# Altium project Battman.PrjPcb (part 1 of 3)
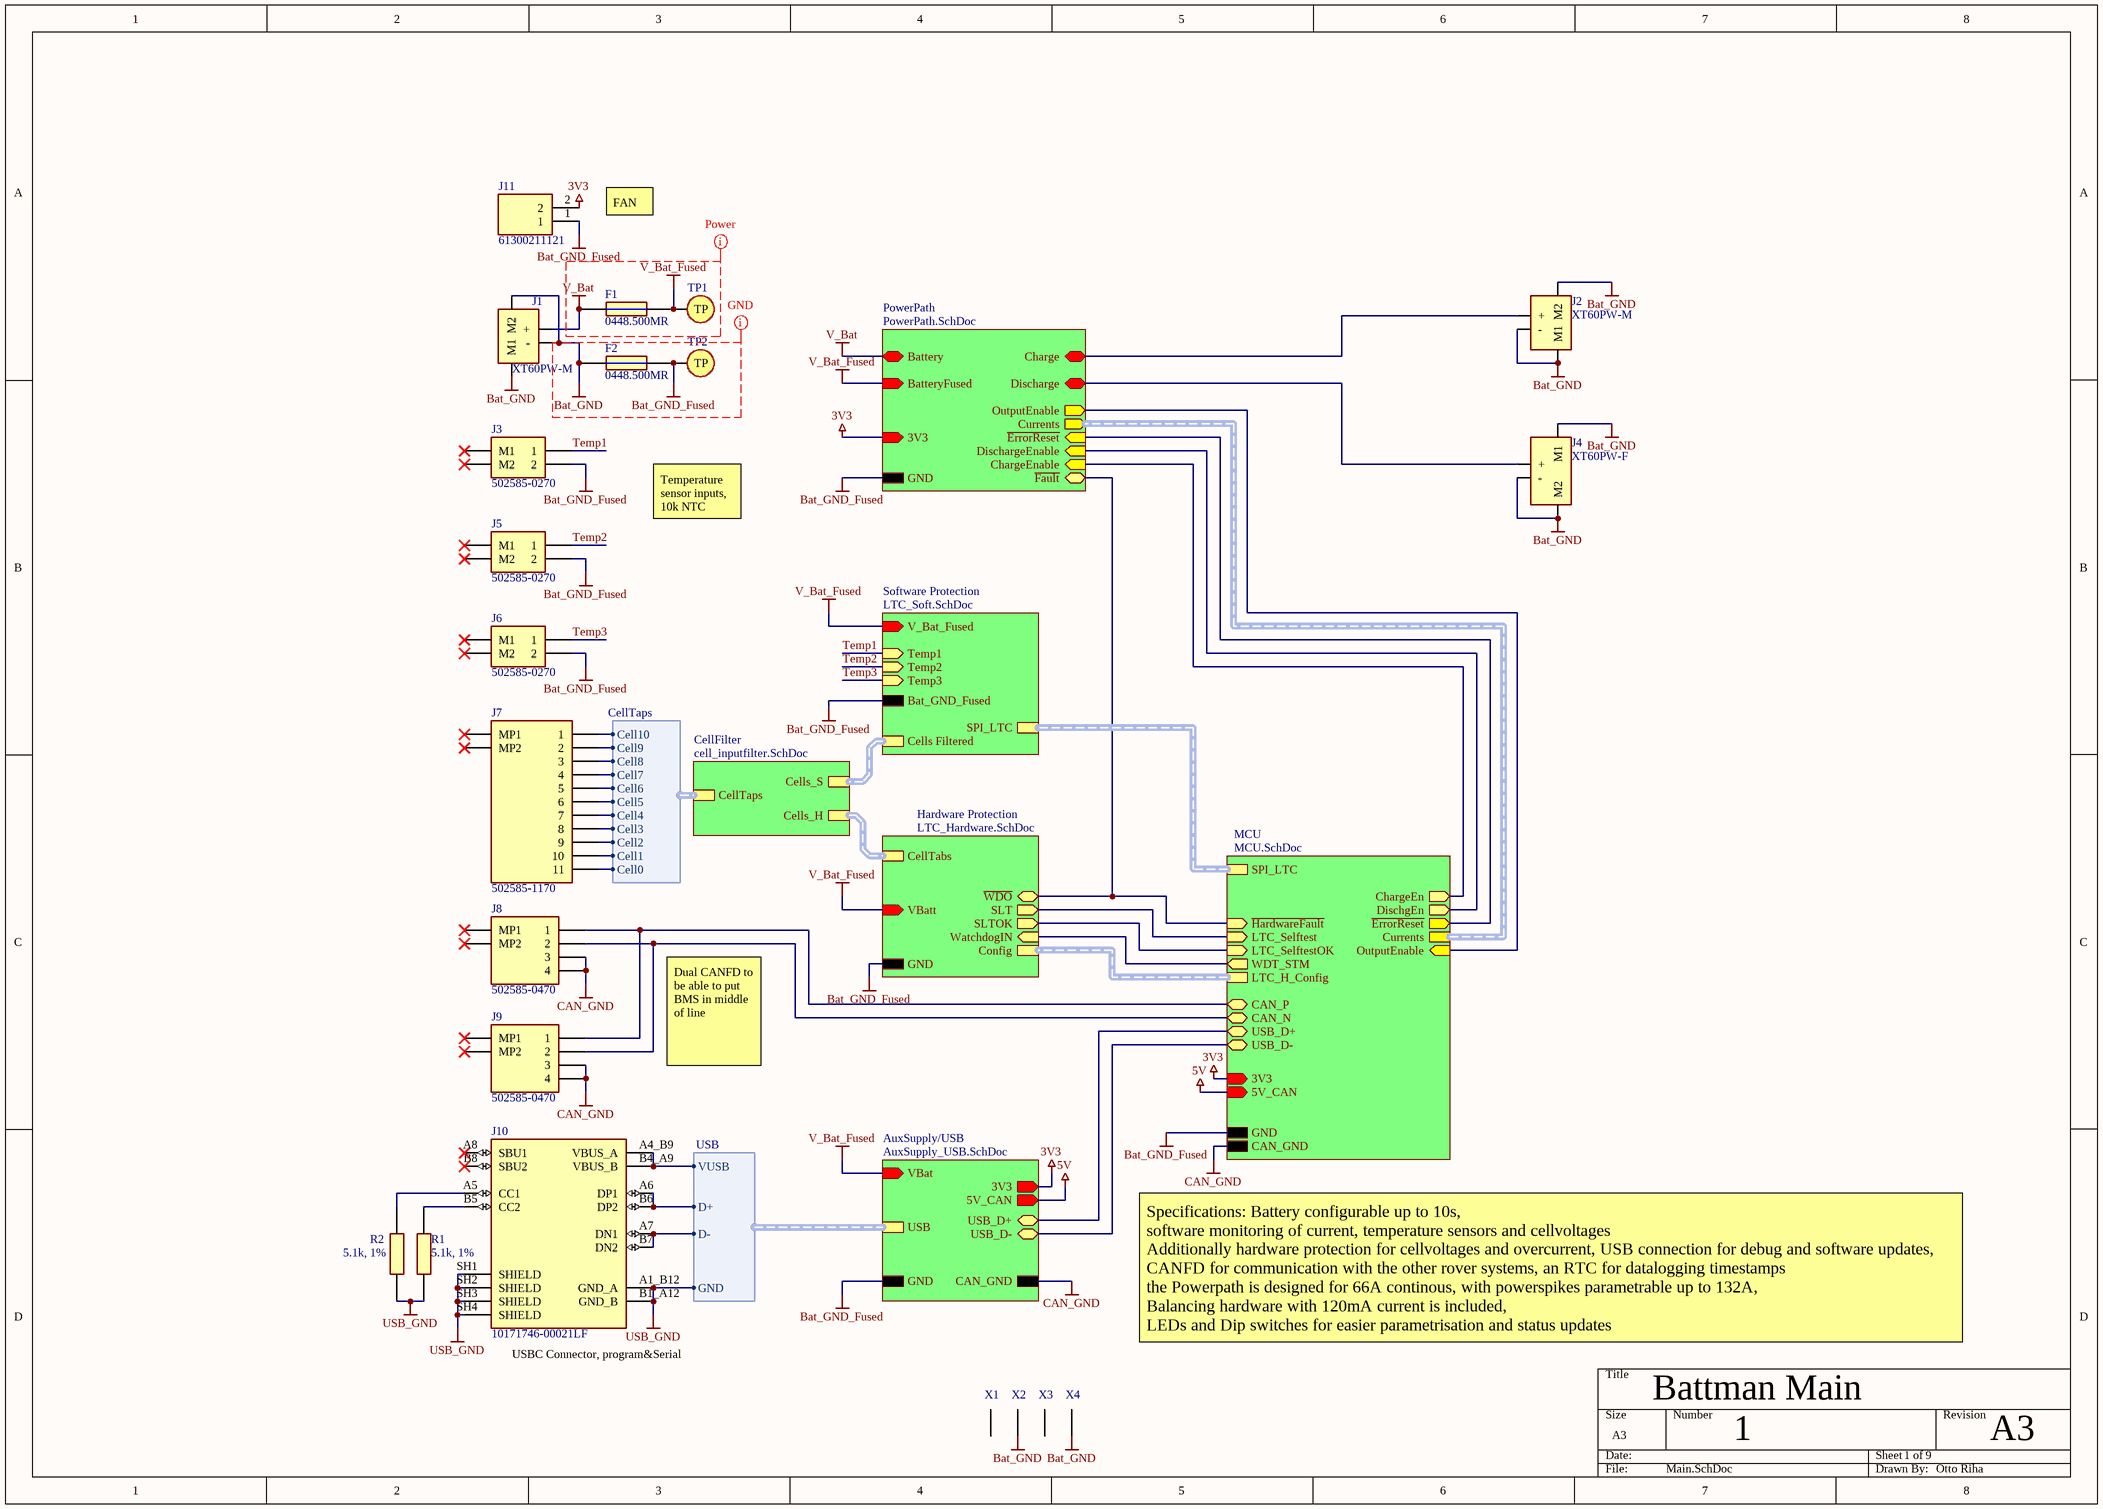
[diagram p0: Main.SchDoc]
10 sheets, 359 parts. Net scope: hierarchical (ports join the sheet entries above them; power ports are global).
Board file: Battman.PcbDoc
Sheets:
  Main.SchDoc
    CellFilter = cell_inputfilter.SchDoc
      CellFilter1 = singlefilter.SchDoc
      CellFilter2 = singlefilter.SchDoc
      CellFilter3 = singlefilter.SchDoc
      CellFilter4 = singlefilter.SchDoc
      CellFilter5 = singlefilter.SchDoc
      CellFilter6 = singlefilter.SchDoc
      CellFilter7 = singlefilter.SchDoc
      CellFilter8 = singlefilter.SchDoc
      CellFilter9 = singlefilter.SchDoc
      CellFilter10 = singlefilter.SchDoc
    Hardware Protection = LTC_Hardware.SchDoc
      Multiplexer1 = ConfigMultiplexer.SchDoc
      Multiplexer2 = ConfigMultiplexer.SchDoc
      Multiplexer3 = ConfigMultiplexer.SchDoc
      Multiplexer4 = ConfigMultiplexer.SchDoc
      Multiplexer5 = ConfigMultiplexer.SchDoc
      Multiplexer6 = ConfigMultiplexer.SchDoc
      Multiplexer7 = ConfigMultiplexer.SchDoc
      Multiplexer8 = ConfigMultiplexer.SchDoc
    AuxSupply/USB = AuxSupply_USB.SchDoc
    Software Protection = LTC_Soft.SchDoc
    MCU = MCU.SchDoc
    PowerPath = PowerPath.SchDoc
      SinglePath1 = Singlepath.SchDoc
      SinglePath2 = Singlepath.SchDoc

## Sheet Main.SchDoc
size A3; SheetNumber: 1; SheetTotal: 10

### Parts
F1  0448.500MR  [FUSC6127X294N]
F2  0448.500MR  [FUSC6127X294N]
J1  XT60PW-M  [XT60PWM]
J2  XT60PW-M  [XT60PWM]
J3  502585-0270  [5025850270]
J4  XT60PW-F  [XT60PWF]
J5  502585-0270  [5025850270]
J6  502585-0270  [5025850270]
J7  502585-1170  [5025851170]
J8  502585-0470  [5025850470]
J9  502585-0470  [5025850470]
J10  10171746-00021LF  [AMPHENOL_10171746-00021LF]
J11  61300211121  [HDRV2W110P0X254_1X2_508X254X854P]
R1  5.1k, 1%  [RESC1608X55N]
R2  5.1k, 1%  [RESC1608X55N]
TP1  Testpoint  [Testpoint]  (value not drawn)
TP2  Testpoint  [Testpoint]  (value not drawn)
X1  Trou pour Vis M3 celon DIN912  [VisM3]  (value not drawn)
X2  Trou pour Vis M3 celon DIN912  [VisM3]  (value not drawn)
X3  Trou pour Vis M3 celon DIN912  [VisM3]  (value not drawn)
X4  Trou pour Vis M3 celon DIN912  [VisM3]  (value not drawn)

### Sub-sheets
AuxSupply/USB = AuxSupply_USB.SchDoc: VBat (in), GND, 5V_CAN (out), 3V3 (out), USB (harness USB), USB_D+ (bidir), USB_D- (bidir), CAN_GND
CellFilter = cell_inputfilter.SchDoc: CellTaps (harness CellTaps), Cells_H (harness Hardware Protection Taps), Cells_S (harness Software Protection Taps)
Hardware Protection = LTC_Hardware.SchDoc: CellTabs (harness Hardware Protection Taps), SLT (out), SLTOK (out), Config (harness LTC_H_Config), WatchdogIN (in), ~{WDO} (bidir), GND, VBatt (in)
MCU = MCU.SchDoc: SPI_LTC (harness SPI_LTC), CAN_P (bidir), CAN_N (bidir), USB_D+ (bidir), USB_D- (bidir), 3V3 (in), 5V_CAN (in), GND, LTC_H_Config (harness LTC_H_Config), ChargeEn (out), DischgEn (out), WDT_STM (out), ~{HardwareFault} (in), LTC_Selftest (in), LTC_SelftestOK (in), ~{ErrorReset} (out), OutputEnable (in), Currents (harness Currents), CAN_GND
PowerPath = PowerPath.SchDoc: Battery (bidir), BatteryFused (in), 3V3 (in), GND, Currents (out), Charge (bidir), ~{Fault} (bidir), Discharge (bidir), ChargeEnable (in), DischargeEnable (in), OutputEnable (out), ~{ErrorReset} (in)
Software Protection = LTC_Soft.SchDoc: Cells Filtered (harness Software Protection Taps), V_Bat_Fused (in), Bat_GND_Fused, Temp1 (in), Temp2 (in), Temp3 (in), SPI_LTC (harness SPI)

### Harnesses
CellTaps: Cell0, Cell1, Cell2, Cell3, Cell4, Cell5, Cell6, Cell7, Cell8, Cell9, Cell10
USB: VUSB, D+, D-, GND

### Nets
3V3: J11.2 ; sheet AuxSupply/USB/3V3, sheet MCU/3V3, sheet PowerPath/3V3  [project net 3.3V]
5V: sheet AuxSupply/USB/5V_CAN, sheet MCU/5V_CAN
5V_USB: J10.A4_B9(VBUS_A) J10.B4_A9(VBUS_B) ; sheet AuxSupply/USB/USB.VUSB
Bat_GND: F2.1 J1.1(-) J1.M1 J1.M2 J2.1(-) J2.M1 J2.M2 J4.2(-) J4.3(M1) J4.4(M2) X2.1(M1) X4.1(M1)
Bat_GND_Fused: F2.2 J3.2 J5.2 J6.2 J11.1 TP2.1(TP) ; sheet Hardware Protection/GND, sheet AuxSupply/USB/GND, sheet Software Protection/Bat_GND_Fused, sheet MCU/GND, sheet PowerPath/GND
CAN_GND: J8.3 J8.4 J9.3 J9.4 ; sheet AuxSupply/USB/CAN_GND, sheet MCU/CAN_GND
USB_GND: J10.A1_B12(GND_A) J10.B1_A12(GND_B) J10.SH1(SHIELD) J10.SH2(SHIELD) J10.SH3(SHIELD) J10.SH4(SHIELD) R1.1 R2.1 ; sheet AuxSupply/USB/USB.GND
V_Bat: F1.1 J1.2(+) ; sheet PowerPath/Battery
V_Bat_Fused: F1.2 TP1.1(TP) ; sheet Hardware Protection/VBatt, sheet AuxSupply/USB/VBat, sheet Software Protection/V_Bat_Fused, sheet PowerPath/BatteryFused
CAN_N: J8.2 J9.2 ; sheet MCU/CAN_N
CAN_P: J8.1 J9.1 ; sheet MCU/CAN_P
Cell1: J7.10 ; sheet CellFilter/CellTaps.Cell1
Cell2: J7.9 ; sheet CellFilter/CellTaps.Cell2
Cell3: J7.8 ; sheet CellFilter/CellTaps.Cell3
Cell4: J7.7 ; sheet CellFilter/CellTaps.Cell4
Cell5: J7.6 ; sheet CellFilter/CellTaps.Cell5
Cell6: J7.5 ; sheet CellFilter/CellTaps.Cell6
Cell7: J7.4 ; sheet CellFilter/CellTaps.Cell7
Cell8: J7.3 ; sheet CellFilter/CellTaps.Cell8
Cell9: J7.2 ; sheet CellFilter/CellTaps.Cell9
Cell10: J7.1 ; sheet CellFilter/CellTaps.Cell10
Enable1: sheet MCU/ChargeEn, sheet PowerPath/ChargeEnable
Enable2: sheet MCU/DischgEn, sheet PowerPath/DischargeEnable
~{Fault}: sheet Hardware Protection/~{WDO}, sheet MCU/~{HardwareFault}, sheet PowerPath/~{Fault}
Out1: J2.2(+) ; sheet PowerPath/Charge
Out2: J4.1(+) ; sheet PowerPath/Discharge
OutputEnable: sheet MCU/OutputEnable, sheet PowerPath/OutputEnable
Temp1: J3.1 ; sheet Software Protection/Temp1
Temp2: J5.1 ; sheet Software Protection/Temp2
Temp3: J6.1 ; sheet Software Protection/Temp3
USB_D_N: J10.A7(DN1) J10.B7(DN2) ; sheet AuxSupply/USB/USB.D-
USB_D_P: J10.A6(DP1) J10.B6(DP2) ; sheet AuxSupply/USB/USB.D+
USB_ISO_N: sheet AuxSupply/USB/USB_D-, sheet MCU/USB_D-
USB_ISO_P: sheet AuxSupply/USB/USB_D+, sheet MCU/USB_D+
NetF100_1: J7.11 ; sheet CellFilter/CellTaps.Cell0
NetIC300_20: sheet Hardware Protection/WatchdogIN, sheet MCU/WDT_STM
NetIC300_28: sheet Hardware Protection/SLTOK, sheet MCU/LTC_SelftestOK
NetIC300_29: sheet Hardware Protection/SLT, sheet MCU/LTC_Selftest
NetIC700#2_27: sheet MCU/~{ErrorReset}, sheet PowerPath/~{ErrorReset}
NetJ10_A5: J10.A5(CC1) R2.2
NetJ10_B5: J10.B5(CC2) R1.2

Not connected (* = marked no-connect by the designer): J3 M1* M2*; J5 M1* M2*; J6 M1* M2*; J7 MP1* MP2*; J8 MP1* MP2*; J9 MP1* MP2*; J10 A8(SBU1)* B8(SBU2)*; X1 1(M1); X3 1(M1)

### Buses and harness runs
harness sheet CellFilter/Cells_H = sheet Hardware Protection/CellTabs
harness sheet CellFilter/Cells_S = sheet Software Protection/Cells Filtered
harness sheet Hardware Protection/Config = sheet MCU/LTC_H_Config
harness sheet MCU/Currents = sheet PowerPath/Currents
harness sheet MCU/SPI_LTC = sheet Software Protection/SPI_LTC

### Layout directives
net class GND: Bat_GND, Bat_GND_Fused
net class Batt+: V_Bat, V_Bat_Fused

### Notes on the sheet
- FAN
- Temperature sensor inputs, 10k NTC
- Dual CANFD to be able to put BMS in middle of line
- (near J10) USBC Connector, program&Serial
- Specifications: Battery configurable up to 10s,
  software monitoring of current, temperature sensors and cellvoltages
  Additionally hardware protection for cellvoltages and overcurrent, USB connection for debug and software updates, CANFD for communication with the other rover systems, an RTC for datalogging timestamps
  the Powerpath is designed for 66A continous, with powerspikes parametrable up to 132A,
  Balancing hardware with 120mA current is included,
  LEDs and Dip switches for easier parametrisation and status updates
- Battman Main
- 1
- 9
- A3
- Otto Riha
- System:
- Car Number:
- Author:
- 127
- Date:
- Sheet
- of
- Version :

### Library data of the parts
F1 F2 = 0448.500MR: Fuse; Manufacturer_Name: LITTELFUSE; Datasheet Link: https://www.mouser.in/datasheet/2/240/Littelfuse_Fuse_448_Datasheet_pdf-970935.pdf; Height: 2.94mm; Manufacturer_Part_Number: 0448.500MR; Mouser Part Number: 576-0448.500MR; Mouser Price/Stock: https://www.mouser.co.uk/ProductDetail/Littelfuse/0448.500MR?qs=sba%2FvSn%252BnuOI9c6%252BQVFrGA%3D%3D; Arrow Part Number: 0448.500MR; Arrow Price/Stock: https://www.arrow.com/en/products/0448.500mr/littelfuse
J1 J2 = XT60PW-M: Connector; Manufacturer_Name: Changzou Amass Elec; Datasheet Link: https://www.tme.eu/Document/9b8d0c5eb7094295f3d3112c214d3ade/XT60PW%20SPEC.pdf; Height: 8.4mm; Manufacturer_Part_Number: XT60PW-M
J3 J5 J6 = 502585-0270: Connector; Manufacturer_Name: Molex; Datasheet Link: https://www.molex.com/pdm_docs/sd/5025850270_sd.pdf; Height: 6.35mm; Manufacturer_Part_Number: 502585-0270; Mouser Part Number: 538-502585-0270; Mouser Price/Stock: https://www.mouser.co.uk/ProductDetail/Molex/502585-0270?qs=3OKVfsn1b5AIV0Cqykd0DA%3D%3D; Arrow Part Number: 502585-0270; Arrow Price/Stock: https://www.arrow.com/en/products/502585-0270/molex
J4 = XT60PW-F: Connector; Manufacturer_Name: Amass; Datasheet Link: https://www.tme.eu/Document/1191bc2fa3aee3c446e5a895fd8f7983/XT60PW-F.pdf; Height: 8.4mm; Manufacturer_Part_Number: XT60PW-F
J7 = 502585-1170: Connector; Manufacturer_Name: Molex; Datasheet Link: https://www.molex.com/pdm_docs/sd/5025851070_sd.pdf; Height: 6.35mm; Manufacturer_Part_Number: 502585-1170; Mouser Part Number: 538-502585-1170; Mouser Price/Stock: https://www.mouser.co.uk/ProductDetail/Molex/502585-1070?qs=3OKVfsn1b5BLfpTO0z92Dw%3D%3D; Arrow Part Number: 502585-1070; Arrow Price/Stock: https://www.arrow.com/en/products/502585-1070/molex
J8 J9 = 502585-0470: Connector; Manufacturer_Name: Molex; Height: 6.6mm; Manufacturer_Part_Number: 502585-0470; Mouser Part Number: 538-502585-0470; Mouser Price/Stock: https://www.mouser.co.uk/ProductDetail/Molex/502585-0470?qs=3OKVfsn1b5AU8ip3wCejKg%3D%3D; Arrow Part Number: 502585-0470; Arrow Price/Stock: https://www.arrow.com/en/products/5025850470/molex
J10 = 10171746-00021LF: USB-C (USB TYPE-C) USB 2.0 Receptacle Connector 24 (6+18 Dummy) Position Surface Mount, Right Angle; Through Hole; MF: Amphenol; SnapEDA_Link: https://www.snapeda.com/parts/10171746-00021LF/Amphenol/view-part/?ref=snap; Package: None; Value: *; MP: 10171746-00021LF; Check_prices: https://www.snapeda.com/parts/10171746-00021LF/Amphenol/view-part/?ref=eda
J11 = 61300211121: Connector; Manufacturer_Name: Wurth Elektronik; Datasheet Link: https://componentsearchengine.com/Datasheets/2/61300211121.pdf; Height: 8.54mm; Manufacturer_Part_Number: 61300211121; Mouser Part Number: 710-61300211121; Mouser Price/Stock: https://www.mouser.co.uk/ProductDetail/Wurth-Elektronik/61300211121?qs=t4813l51qx%252B1A5GYDQxPlw%3D%3D
R1 R2 = CRCW06035K10FKEBC: Resistor 5.1k, 1%; Manufacturer_Name: Vishay; Datasheet Link: https://www.vishay.com/docs/28773/crcwce3.pdf; Height: 0.55mm; Manufacturer_Part_Number: CRCW06035K10FKEBC; Mouser Part Number: 71-CRCW06035K10FKEBC; Mouser Price/Stock: https://www.mouser.co.uk/ProductDetail/Vishay-Dale/CRCW06035K10FKEBC?qs=wd5RIQLrsJiajonkePuzqw%3D%3D; Arrow Part Number: CRCW06035K10FKEBC; Arrow Price/Stock: https://www.arrow.com/en/products/crcw06035k10fkebc/vishay?region=nac; Value: 5.1k; Supplier 1: Mouser; Supplier Part Number 1: 71-CRCW06035K10FKEBC
X1-X4 = VisM3

## Sheet cell_inputfilter.SchDoc
size A4 portrait; SheetNumber: 2; SheetTotal: 10
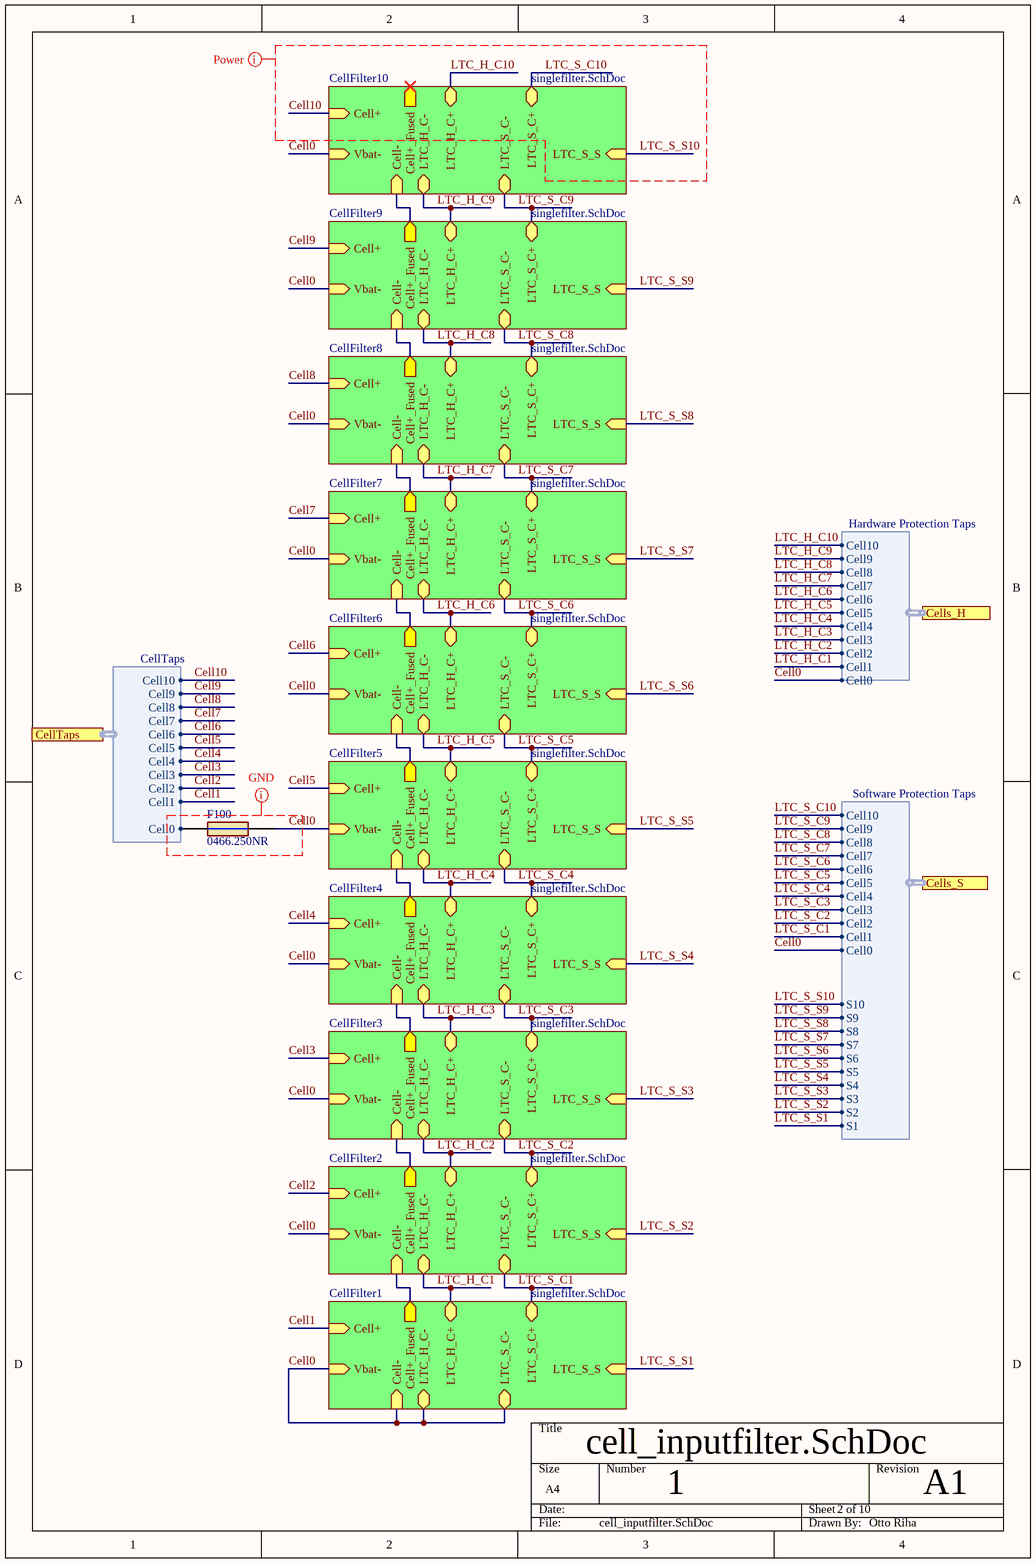
[diagram p1: cell_inputfilter.SchDoc]

### Parts
F100  0466.250NR  [FUSC3215X66N]

### Sub-sheets
CellFilter1 = singlefilter.SchDoc: Cell+ (in), Cell- (in), Vbat- (in), LTC_S_C+ (bidir), LTC_H_C+ (bidir), LTC_H_C- (bidir), LTC_S_C- (bidir), LTC_S_S (in), Cell+_Fused (out)
CellFilter2 = singlefilter.SchDoc: Cell+ (in), Cell- (in), Vbat- (in), LTC_S_C+ (bidir), LTC_H_C+ (bidir), LTC_H_C- (bidir), LTC_S_C- (bidir), LTC_S_S (in), Cell+_Fused (out)
CellFilter3 = singlefilter.SchDoc: Cell+ (in), Cell- (in), Vbat- (in), LTC_S_C+ (bidir), LTC_H_C+ (bidir), LTC_H_C- (bidir), LTC_S_C- (bidir), LTC_S_S (in), Cell+_Fused (out)
CellFilter4 = singlefilter.SchDoc: Cell+ (in), Cell- (in), Vbat- (in), LTC_S_C+ (bidir), LTC_H_C+ (bidir), LTC_H_C- (bidir), LTC_S_C- (bidir), LTC_S_S (in), Cell+_Fused (out)
CellFilter5 = singlefilter.SchDoc: Cell+ (in), Cell- (in), Vbat- (in), LTC_S_C+ (bidir), LTC_H_C+ (bidir), LTC_H_C- (bidir), LTC_S_C- (bidir), LTC_S_S (in), Cell+_Fused (out)
CellFilter6 = singlefilter.SchDoc: Cell+ (in), Cell- (in), Vbat- (in), LTC_S_C+ (bidir), LTC_H_C+ (bidir), LTC_H_C- (bidir), LTC_S_C- (bidir), LTC_S_S (in), Cell+_Fused (out)
CellFilter7 = singlefilter.SchDoc: Cell+ (in), Cell- (in), Vbat- (in), LTC_S_C+ (bidir), LTC_H_C+ (bidir), LTC_H_C- (bidir), LTC_S_C- (bidir), LTC_S_S (in), Cell+_Fused (out)
CellFilter8 = singlefilter.SchDoc: Cell+ (in), Cell- (in), Vbat- (in), LTC_S_C+ (bidir), LTC_H_C+ (bidir), LTC_H_C- (bidir), LTC_S_C- (bidir), LTC_S_S (in), Cell+_Fused (out)
CellFilter9 = singlefilter.SchDoc: Cell+ (in), Cell- (in), Vbat- (in), LTC_S_C+ (bidir), LTC_H_C+ (bidir), LTC_H_C- (bidir), LTC_S_C- (bidir), LTC_S_S (in), Cell+_Fused (out)
CellFilter10 = singlefilter.SchDoc: Cell+ (in), Cell- (in), Vbat- (in), LTC_S_C+ (bidir), LTC_H_C+ (bidir), LTC_H_C- (bidir), LTC_S_C- (bidir), LTC_S_S (in), Cell+_Fused (out)

### Ports
Cells_H (harness Hardware Protection Taps, see Main[4C]), Cells_S (harness Software Protection Taps, see Main[4C]), CellTaps (harness CellTaps, see Main[3C])

### Harnesses
CellTaps: Cell9, Cell10, Cell0, Cell1, Cell2, Cell3, Cell4, Cell5, Cell6, Cell7, Cell8
Hardware Protection Taps: Cell0, Cell1, Cell2, Cell3, Cell4, Cell5, Cell6, Cell7, Cell8, Cell9, Cell10
Software Protection Taps: Cell0, Cell1, Cell2, Cell3, Cell4, Cell5, Cell6, Cell7, Cell8, Cell9, Cell10, S1, S2, S3, S4, S5, S6, S7, S8, S9, S10

### Nets
Cell0: F100.2 ; sheet CellFilter1/Cell-, sheet CellFilter1/Vbat-, sheet CellFilter1/LTC_H_C-, sheet CellFilter1/LTC_S_C-, sheet CellFilter2/Vbat-, sheet CellFilter3/Vbat-, sheet CellFilter4/Vbat-, sheet CellFilter5/Vbat-, sheet CellFilter6/Vbat-, sheet CellFilter7/Vbat-, sheet CellFilter8/Vbat-, sheet CellFilter9/Vbat-, sheet CellFilter10/Vbat-, port Cells_H.Cell0, port Cells_S.Cell0
Cell1: sheet CellFilter1/Cell+, port CellTaps.Cell1
Cell2: sheet CellFilter2/Cell+, port CellTaps.Cell2
Cell3: sheet CellFilter3/Cell+, port CellTaps.Cell3
Cell4: sheet CellFilter4/Cell+, port CellTaps.Cell4
Cell5: sheet CellFilter5/Cell+, port CellTaps.Cell5
Cell6: sheet CellFilter6/Cell+, port CellTaps.Cell6
Cell7: sheet CellFilter7/Cell+, port CellTaps.Cell7
Cell8: sheet CellFilter8/Cell+, port CellTaps.Cell8
Cell9: sheet CellFilter9/Cell+, port CellTaps.Cell9
Cell10: sheet CellFilter10/Cell+, port CellTaps.Cell10
LTC_H_C1: sheet CellFilter1/LTC_H_C+, sheet CellFilter2/LTC_H_C-, port Cells_H.Cell1
LTC_H_C2: sheet CellFilter2/LTC_H_C+, sheet CellFilter3/LTC_H_C-, port Cells_H.Cell2
LTC_H_C3: sheet CellFilter3/LTC_H_C+, sheet CellFilter4/LTC_H_C-, port Cells_H.Cell3
LTC_H_C4: sheet CellFilter4/LTC_H_C+, sheet CellFilter5/LTC_H_C-, port Cells_H.Cell4
LTC_H_C5: sheet CellFilter5/LTC_H_C+, sheet CellFilter6/LTC_H_C-, port Cells_H.Cell5
LTC_H_C6: sheet CellFilter6/LTC_H_C+, sheet CellFilter7/LTC_H_C-, port Cells_H.Cell6
LTC_H_C7: sheet CellFilter7/LTC_H_C+, sheet CellFilter8/LTC_H_C-, port Cells_H.Cell7
LTC_H_C8: sheet CellFilter8/LTC_H_C+, sheet CellFilter9/LTC_H_C-, port Cells_H.Cell8
LTC_H_C9: sheet CellFilter9/LTC_H_C+, sheet CellFilter10/LTC_H_C-, port Cells_H.Cell9
LTC_H_C10: sheet CellFilter10/LTC_H_C+, port Cells_H.Cell10
LTC_S_C1: sheet CellFilter1/LTC_S_C+, sheet CellFilter2/LTC_S_C-, port Cells_S.Cell1
LTC_S_C2: sheet CellFilter2/LTC_S_C+, sheet CellFilter3/LTC_S_C-, port Cells_S.Cell2
LTC_S_C3: sheet CellFilter3/LTC_S_C+, sheet CellFilter4/LTC_S_C-, port Cells_S.Cell3
LTC_S_C4: sheet CellFilter4/LTC_S_C+, sheet CellFilter5/LTC_S_C-, port Cells_S.Cell4
LTC_S_C5: sheet CellFilter5/LTC_S_C+, sheet CellFilter6/LTC_S_C-, port Cells_S.Cell5
LTC_S_C6: sheet CellFilter6/LTC_S_C+, sheet CellFilter7/LTC_S_C-, port Cells_S.Cell6
LTC_S_C7: sheet CellFilter7/LTC_S_C+, sheet CellFilter8/LTC_S_C-, port Cells_S.Cell7
LTC_S_C8: sheet CellFilter8/LTC_S_C+, sheet CellFilter9/LTC_S_C-, port Cells_S.Cell8
LTC_S_C9: sheet CellFilter9/LTC_S_C+, sheet CellFilter10/LTC_S_C-, port Cells_S.Cell9
LTC_S_C10: sheet CellFilter10/LTC_S_C+, port Cells_S.Cell10
LTC_S_S1: sheet CellFilter1/LTC_S_S, port Cells_S.S1
LTC_S_S2: sheet CellFilter2/LTC_S_S, port Cells_S.S2
LTC_S_S3: sheet CellFilter3/LTC_S_S, port Cells_S.S3
LTC_S_S4: sheet CellFilter4/LTC_S_S, port Cells_S.S4
LTC_S_S5: sheet CellFilter5/LTC_S_S, port Cells_S.S5
LTC_S_S6: sheet CellFilter6/LTC_S_S, port Cells_S.S6
LTC_S_S7: sheet CellFilter7/LTC_S_S, port Cells_S.S7
LTC_S_S8: sheet CellFilter8/LTC_S_S, port Cells_S.S8
LTC_S_S9: sheet CellFilter9/LTC_S_S, port Cells_S.S9
LTC_S_S10: sheet CellFilter10/LTC_S_S, port Cells_S.S10
NetF100_1: F100.1 ; port CellTaps.Cell0
NetF200A_2: sheet CellFilter1/Cell+_Fused, sheet CellFilter2/Cell-
NetF200B_2: sheet CellFilter2/Cell+_Fused, sheet CellFilter3/Cell-
NetF200C_2: sheet CellFilter3/Cell+_Fused, sheet CellFilter4/Cell-
NetF200D_2: sheet CellFilter4/Cell+_Fused, sheet CellFilter5/Cell-
NetF200E_2: sheet CellFilter5/Cell+_Fused, sheet CellFilter6/Cell-
NetF200F_2: sheet CellFilter6/Cell+_Fused, sheet CellFilter7/Cell-
NetF200G_2: sheet CellFilter7/Cell+_Fused, sheet CellFilter8/Cell-
NetF200H_2: sheet CellFilter8/Cell+_Fused, sheet CellFilter9/Cell-
NetF200I_2: sheet CellFilter9/Cell+_Fused, sheet CellFilter10/Cell-

### Layout directives
net class Batt+: Cell10, LTC_H_C10, LTC_S_C10, LTC_S_S10
net class GND: Cell0

### Notes on the sheet
- 1
- A1
- Otto Riha

### Library data of the parts
F100 = 0466.250NR: Fuse; Manufacturer_Name: LITTELFUSE; Datasheet Link: http://www.littelfuse.com/~/media/electronics/datasheets/fuses/littelfuse_fuse_466_datasheet.pdf.pdf; Height: 0.66mm; Manufacturer_Part_Number: 0466.250NR; Mouser Part Number: 576-0466.250NR; Mouser Price/Stock: https://www.mouser.co.uk/ProductDetail/Littelfuse/0466.250NR?qs=OJFHm2hVE4FeDcEECJ4GEQ%3D%3D; Arrow Part Number: 0466.250NR; Arrow Price/Stock: https://www.arrow.com/en/products/0466.250nr/littelfuse?region=nac

## Sheet singlefilter.SchDoc
size A4; SheetNumber: 3; SheetTotal: 10
Used 10 times, as channels CellFilter/CellFilter1, CellFilter/CellFilter2, CellFilter/CellFilter3, CellFilter/CellFilter4, CellFilter/CellFilter5, CellFilter/CellFilter6, CellFilter/CellFilter7, CellFilter/CellFilter8, CellFilter/CellFilter9, CellFilter/CellFilter10. Parts and nets are listed once, with the designators drawn on the sheet.
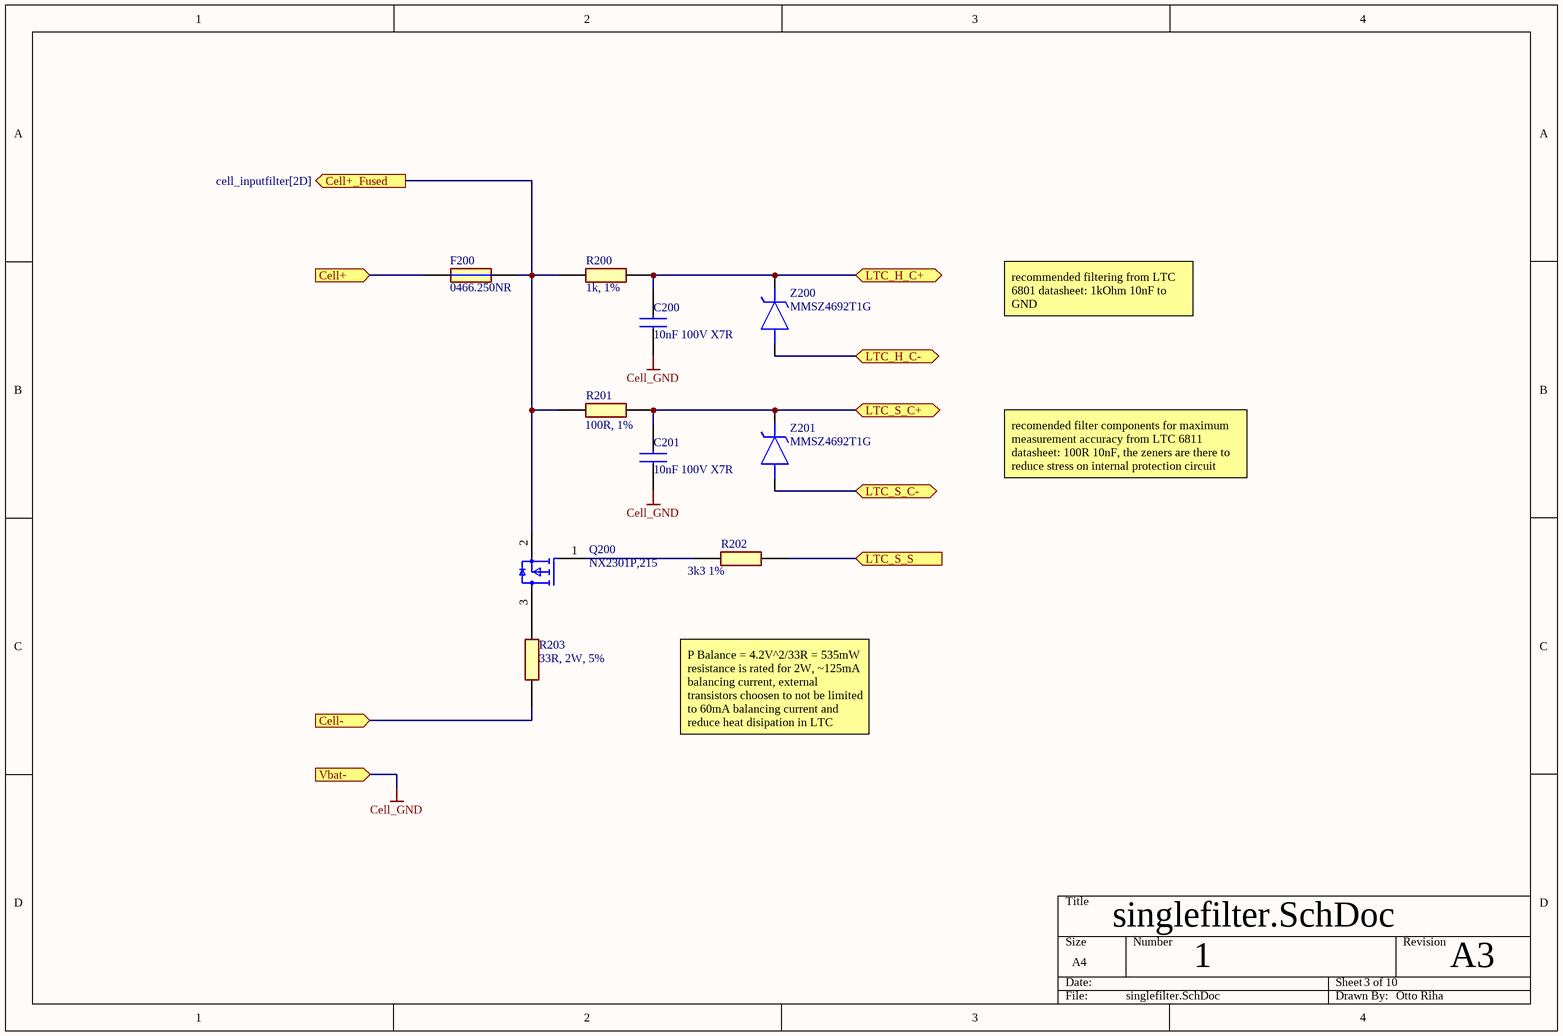
[diagram p2: singlefilter.SchDoc]

### Parts
C200  10nF 100V X7R  [CAPC1608X90N]
C201  10nF 100V X7R  [CAPC1608X90N]
F200  0466.250NR  [FUSC3215X66N]
Q200  NX2301P,215  [SOT95P230X110-3N]
R200  value 1k, 1%  [RESC1608X55N]  (hidden comment: AF0603FR-071KL)
R201  100R, 1%  [RESC1608X50N]
R202  3k3 1%  [RESC1608X55N]
R203  33R, 2W, 5%  [RESC6331X80N]
Z200  MMSZ4692T1G  [SOD3716X135N]
Z201  MMSZ4692T1G  [SOD3716X135N]

### Ports
Cell+ (in, see cell_inputfilter[2D]), Cell+_Fused (out, see cell_inputfilter[2D]), Cell- (in, see cell_inputfilter[2D]), LTC_H_C+ (bidir, see cell_inputfilter[2D]), LTC_H_C- (bidir, see cell_inputfilter[2D]), LTC_S_C+ (bidir, see cell_inputfilter[3D]), LTC_S_C- (bidir, see cell_inputfilter[2D]), LTC_S_S (in, see cell_inputfilter[3D]), Vbat- (in, see cell_inputfilter[2D])

### Nets
Cell_GND: C200.1 C201.1 ; port Vbat-
Cell+: F200.1 ; port Cell+
Cell+_Fused: F200.2 Q200.2(S) R200.1 R201.1 ; port Cell+_Fused
Cell-: R203.1 ; port Cell-
LTC_H_C+: C200.2 R200.2 Z200.1(K) ; port LTC_H_C+
LTC_H_C-: Z200.2(A) ; port LTC_H_C-
LTC_S_C+: C201.2 R201.2 Z201.1(K) ; port LTC_S_C+
LTC_S_C-: Z201.2(A) ; port LTC_S_C-
LTC_S_S: R202.2 ; port LTC_S_S
NetQ200_1: Q200.1(G) R202.1
NetQ200_3: Q200.3(D) R203.2

### Channels
CellFilter/CellFilter1: designators end in A; ports Cell+=Cell1 Cell+_Fused=NetF200A_2 Cell-=Cell0 LTC_H_C+=LTC_H_C1 LTC_H_C-=Cell0 LTC_S_C+=LTC_S_C1 LTC_S_C-=Cell0 LTC_S_S=LTC_S_S1 Vbat-=Cell0
CellFilter/CellFilter2: designators end in B; ports Cell+=Cell2 Cell+_Fused=NetF200B_2 Cell-=NetF200A_2 LTC_H_C+=LTC_H_C2 LTC_H_C-=LTC_H_C1 LTC_S_C+=LTC_S_C2 LTC_S_C-=LTC_S_C1 LTC_S_S=LTC_S_S2 Vbat-=Cell0
CellFilter/CellFilter3: designators end in C; ports Cell+=Cell3 Cell+_Fused=NetF200C_2 Cell-=NetF200B_2 LTC_H_C+=LTC_H_C3 LTC_H_C-=LTC_H_C2 LTC_S_C+=LTC_S_C3 LTC_S_C-=LTC_S_C2 LTC_S_S=LTC_S_S3 Vbat-=Cell0
CellFilter/CellFilter4: designators end in D; ports Cell+=Cell4 Cell+_Fused=NetF200D_2 Cell-=NetF200C_2 LTC_H_C+=LTC_H_C4 LTC_H_C-=LTC_H_C3 LTC_S_C+=LTC_S_C4 LTC_S_C-=LTC_S_C3 LTC_S_S=LTC_S_S4 Vbat-=Cell0
CellFilter/CellFilter5: designators end in E; ports Cell+=Cell5 Cell+_Fused=NetF200E_2 Cell-=NetF200D_2 LTC_H_C+=LTC_H_C5 LTC_H_C-=LTC_H_C4 LTC_S_C+=LTC_S_C5 LTC_S_C-=LTC_S_C4 LTC_S_S=LTC_S_S5 Vbat-=Cell0
CellFilter/CellFilter6: designators end in F; ports Cell+=Cell6 Cell+_Fused=NetF200F_2 Cell-=NetF200E_2 LTC_H_C+=LTC_H_C6 LTC_H_C-=LTC_H_C5 LTC_S_C+=LTC_S_C6 LTC_S_C-=LTC_S_C5 LTC_S_S=LTC_S_S6 Vbat-=Cell0
CellFilter/CellFilter7: designators end in G; ports Cell+=Cell7 Cell+_Fused=NetF200G_2 Cell-=NetF200F_2 LTC_H_C+=LTC_H_C7 LTC_H_C-=LTC_H_C6 LTC_S_C+=LTC_S_C7 LTC_S_C-=LTC_S_C6 LTC_S_S=LTC_S_S7 Vbat-=Cell0
CellFilter/CellFilter8: designators end in H; ports Cell+=Cell8 Cell+_Fused=NetF200H_2 Cell-=NetF200G_2 LTC_H_C+=LTC_H_C8 LTC_H_C-=LTC_H_C7 LTC_S_C+=LTC_S_C8 LTC_S_C-=LTC_S_C7 LTC_S_S=LTC_S_S8 Vbat-=Cell0
CellFilter/CellFilter9: designators end in I; ports Cell+=Cell9 Cell+_Fused=NetF200I_2 Cell-=NetF200H_2 LTC_H_C+=LTC_H_C9 LTC_H_C-=LTC_H_C8 LTC_S_C+=LTC_S_C9 LTC_S_C-=LTC_S_C8 LTC_S_S=LTC_S_S9 Vbat-=Cell0
CellFilter/CellFilter10: designators end in J; ports Cell+=Cell10 Cell+_Fused=NetF200J_2 Cell-=NetF200I_2 LTC_H_C+=LTC_H_C10 LTC_H_C-=LTC_H_C9 LTC_S_C+=LTC_S_C10 LTC_S_C-=LTC_S_C9 LTC_S_S=LTC_S_S10 Vbat-=Cell0

### Notes on the sheet
- recommended filtering from LTC 6801 datasheet: 1kOhm 10nF to GND
- recomended filter components for maximum measurement accuracy from LTC 6811 datasheet: 100R 10nF, the zeners are there to reduce stress on internal protection circuit
- P Balance = 4.2V^2/33R = 535mW resistance is rated for 2W, ~125mA balancing current, external transistors choosen to not be limited to 60mA balancing current and reduce heat disipation in LTC
- 1
- A3
- Otto Riha

### Library data of the parts
C200 C201 = 06031C103K4Z2A: Capacitor 10nF 100V X7R; Manufacturer_Name: Kyocera AVX; Datasheet Link: https://componentsearchengine.com/Datasheets/1/06031A100FAT2A.pdf; Height: 0.9mm; Manufacturer_Part_Number: 06031C103K4Z2A; Mouser Part Number: 581-06031C103K4Z2A; Mouser Price/Stock: https://www.mouser.com/Search/Refine.aspx?Keyword=581-06031C103K4Z2A; Arrow Part Number: 06031C103K4Z2A; Arrow Price/Stock: https://www.arrow.com/en/products/06031c103k4z2a/avx; Value: 10nF
F200 = 0466.250NR: Fuse; Manufacturer_Name: LITTELFUSE; Datasheet Link: http://www.littelfuse.com/~/media/electronics/datasheets/fuses/littelfuse_fuse_466_datasheet.pdf.pdf; Height: 0.66mm; Manufacturer_Part_Number: 0466.250NR; Mouser Part Number: 576-0466.250NR; Mouser Price/Stock: https://www.mouser.co.uk/ProductDetail/Littelfuse/0466.250NR?qs=OJFHm2hVE4FeDcEECJ4GEQ%3D%3D; Arrow Part Number: 0466.250NR; Arrow Price/Stock: https://www.arrow.com/en/products/0466.250nr/littelfuse?region=nac
Q200 = NX2301P,215: Integrated Circuit; Manufacturer_Name: Nexperia; Datasheet Link: https://assets.nexperia.com/documents/data-sheet/NX2301P.pdf; Height: 1.1mm; Manufacturer_Part_Number: NX2301P,215; Mouser Part Number: 771-NX2301P215; Mouser Price/Stock: https://www.mouser.co.uk/ProductDetail/Nexperia/NX2301P215?qs=A1cBxND5mHKs%252BLrxCDENxw%3D%3D; Arrow Part Number: NX2301P,215; Arrow Price/Stock: https://www.arrow.com/en/products/nx2301p215/nexperia?utm_currency=USD&region=europe
R200 = AF0603FR-071KL: Resistor 1k, 1%; Manufacturer_Name: YAGEO; Datasheet Link: https://www.mouser.de/datasheet/2/447/PYu_AF_51_RoHS_L_9-3358811.pdf; Height: 0.55mm; Manufacturer_Part_Number: AF0603FR-071KL; Mouser Part Number: 603-AF0603FR-071KL; Mouser Price/Stock: https://www.mouser.co.uk/ProductDetail/YAGEO/AF0603FR-071KL?qs=tggtontpCXPK7%252BIEiEzGxw%3D%3D; Supplier 1: Avnet; Supplier Part Number 1: AF0603FR-071KL
R201 = CRCW0603100RFKEA: Resistor 100R, 1%; Manufacturer_Name: Vishay; Datasheet Link: http://www.vishay.com/docs/20035/dcrcwe3.pdf; Height: 0.5mm; Manufacturer_Part_Number: CRCW0603100RFKEA; Mouser Part Number: 71-CRCW0603-100-E3; Mouser Price/Stock: https://www.mouser.co.uk/ProductDetail/Vishay-Dale/CRCW0603100RFKEA?qs=90AHS1y%2FsidGWjjxZAupKg%3D%3D; Arrow Part Number: CRCW0603100RFKEA; Arrow Price/Stock: https://www.arrow.com/en/products/crcw0603100rfkea/vishay?utm_currency=USD&region=europe; Supplier 1: Mouser; Supplier Part Number 1: 71-CRCW0603-100-E3; Value: 100R
R202 = CRGH0603F3K3: Resistor 3k3 1%; Manufacturer_Name: TE Connectivity; Datasheet Link: http://docs-europe.electrocomponents.com/webdocs/12d7/0900766b812d7379.pdf; Height: 0.55mm; Manufacturer_Part_Number: CRGH0603F3K3; Mouser Part Number: 279-CRGH0603F3K3; Value: 3k3; Supplier 1: Avnet; Supplier Part Number 1: 46AK9312
R203 = CRM2512-JW-330ELF: Resistor 33R, 2W, 5%; Manufacturer_Name: Bourns; Datasheet Link: http://www.bourns.com/data/global/pdfs/CRM0805_1206_2010.pdf; Height: 0.8mm; Manufacturer_Part_Number: CRM2512-JW-330ELF; Mouser Part Number: 652-CRM2512JW330ELF; Mouser Price/Stock: https://www.mouser.co.uk/ProductDetail/Bourns/CRM2512-JW-330ELF?qs=dxeCVZFKEXcR8BXxHz0dQA%3D%3D; Supplier 1: Mouser; Supplier Part Number 1: 652-CRM2512JW330ELF
Z200 Z201 = MMSZ4692T1G: Zener Diode 6.8V; Manufacturer_Name: onsemi; Datasheet Link: https://www.onsemi.com/pub/Collateral/MMSZ4678T1-D.PDF; Height: 1.35mm; Manufacturer_Part_Number: MMSZ4692T1G; Mouser Part Number: 863-MMSZ4692T1G; Mouser Price/Stock: https://www.mouser.co.uk/ProductDetail/onsemi/MMSZ4692T1G?qs=P4IOph%252Bbot8jSn3zyyx1xw%3D%3D; Arrow Part Number: MMSZ4692T1G; Arrow Price/Stock: https://www.arrow.com/en/products/mmsz4692t1g/on-semiconductor

## Sheet LTC_Hardware.SchDoc
size A4; SheetNumber: 4; SheetTotal: 10
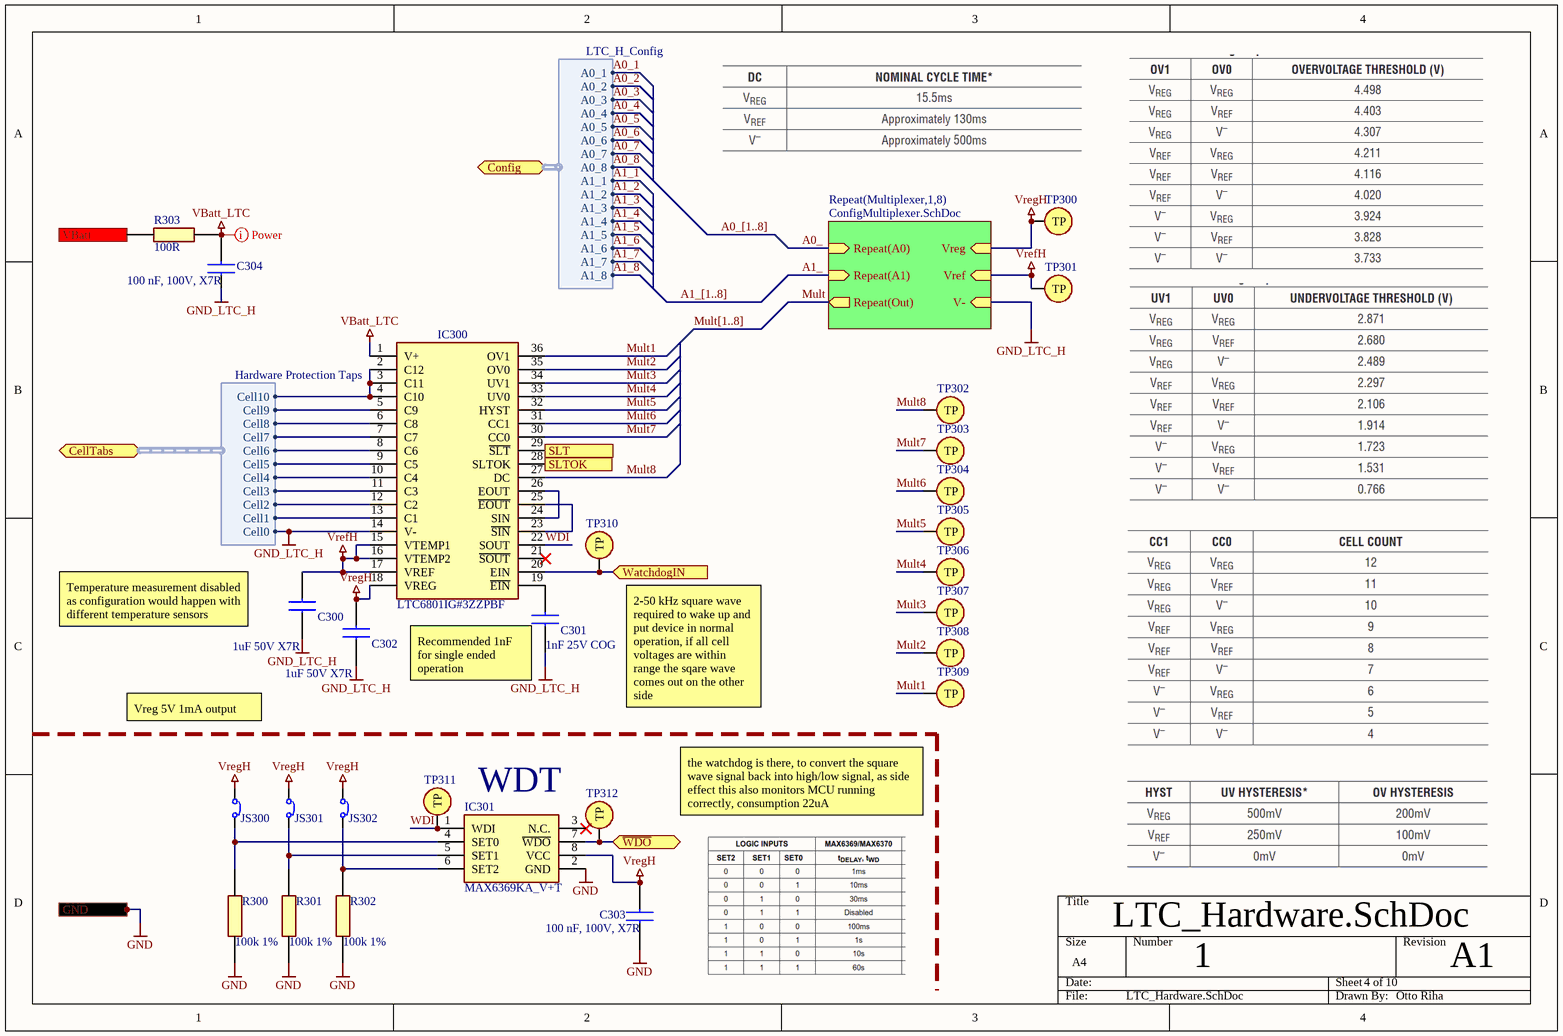
[diagram p3: LTC_Hardware.SchDoc]

### Parts
C300  1uF 50V X7R  [CAPC1608X90N]
C301  1nF 25V COG  [CAPC1608X90N]
C302  1uF 50V X7R  [CAPC1608X90N]
C303  100 nF, 100V, X7R  [MAJx16]
C304  100 nF, 100V, X7R  [MAJx16]
IC300  LTC6801IG#3ZZPBF  [SOP65P780X200-36N]
IC301  MAX6369KA_V+T  [SOT65P280X145-8N]
JS300  SolderJumper  [SolderJumper]  (value not drawn)
JS301  SolderJumper  [SolderJumper]  (value not drawn)
JS302  SolderJumper  [SolderJumper]  (value not drawn)
R300  100k 1%  [RESC1608X55N]
R301  100k 1%  [RESC1608X55N]
R302  100k 1%  [RESC1608X55N]
R303  value 100R  [RESC1608X50N]  (hidden comment: CRCW0603100RFKEA)
TP300  Testpoint  [Testpoint]  (value not drawn)
TP301  Testpoint  [Testpoint]  (value not drawn)
TP302  Testpoint  [Testpoint]  (value not drawn)
TP303  Testpoint  [Testpoint]  (value not drawn)
TP304  Testpoint  [Testpoint]  (value not drawn)
TP305  Testpoint  [Testpoint]  (value not drawn)
TP306  Testpoint  [Testpoint]  (value not drawn)
TP307  Testpoint  [Testpoint]  (value not drawn)
TP308  Testpoint  [Testpoint]  (value not drawn)
TP309  Testpoint  [Testpoint]  (value not drawn)
TP310  Testpoint  [Testpoint]  (value not drawn)
TP311  Testpoint  [Testpoint]  (value not drawn)
TP312  Testpoint  [Testpoint]  (value not drawn)

### Sub-sheets
Repeat(Multiplexer,1,8) = ConfigMultiplexer.SchDoc: Repeat(A0) (in), Repeat(A1) (in), Repeat(Out) (out), Vreg (in), Vref (in), V- (in)

### Ports
CellTabs (bidir, harness Hardware Protection Taps, see Main[4C]), Config (bidir, harness LTC_H_Config, see Main[4C]), GND (see Main[4C], AuxSupply_USB[1C], MCU[1A], PowerPath[1B], Singlepath[1C]), SLT (out, see Main[4C]), SLTOK (out, see Main[4C]), VBatt (in, see Main[4C]), WatchdogIN (in, see Main[4C]), ~{WDO} (bidir, see Main[4C])

### Harnesses
Hardware Protection Taps: Cell0, Cell1, Cell2, Cell3, Cell4, Cell5, Cell6, Cell7, Cell8, Cell9, Cell10
LTC_H_Config: A0_1, A0_2, A0_3, A0_4, A0_5, A0_6, A0_7, A0_8, A1_1, A1_2, A1_3, A1_4, A1_5, A1_6, A1_7, A1_8

### Nets
GND: C303.1 IC301.2(GND) R300.1 R301.1 R302.1 ; port GND  [project net Bat_GND_Fused]
GND_LTC_H: C300.2 C301.1 C302.2 C304.1 IC300.14(V-) ; sheet Repeat(Multiplexer,1,8)/V-, port CellTabs.Cell0  [project net Cell0]
V_Bat_Fused: R303.1 ; port VBatt
VBatt_LTC: C304.2 IC300.1(V+) R303.2
VrefH: C300.1 IC300.15(VTEMP1) IC300.16(VTEMP2) IC300.17(VREF) TP301.1(TP) ; sheet Repeat(Multiplexer,1,8)/Vref
VregH: C302.1 C303.2 IC300.18(VREG) IC301.8(VCC) JS300.2 JS301.2 JS302.2 TP300.1(TP) ; sheet Repeat(Multiplexer,1,8)/Vreg  [project net Vreg]
A0_: sheet Repeat(Multiplexer,1,8)/Repeat(A0)
A1_: sheet Repeat(Multiplexer,1,8)/Repeat(A1)
~{Fault}: IC301.7(~{WDO}) TP312.1(TP) ; port ~{WDO}
LTC_H_C1: IC300.13(C1) ; port CellTabs.Cell1
LTC_H_C2: IC300.12(C2) ; port CellTabs.Cell2
LTC_H_C3: IC300.11(C3) ; port CellTabs.Cell3
LTC_H_C4: IC300.10(C4) ; port CellTabs.Cell4
LTC_H_C5: IC300.9(C5) ; port CellTabs.Cell5
LTC_H_C6: IC300.8(C6) ; port CellTabs.Cell6
LTC_H_C7: IC300.7(C7) ; port CellTabs.Cell7
LTC_H_C8: IC300.6(C8) ; port CellTabs.Cell8
LTC_H_C9: IC300.5(C9) ; port CellTabs.Cell9
LTC_H_C10: IC300.2(C12) IC300.3(C11) IC300.4(C10) ; port CellTabs.Cell10
Mult: sheet Repeat(Multiplexer,1,8)/Repeat(Out)
Mult1: IC300.36(OV1) TP309.1(TP)
Mult2: IC300.35(OV0) TP308.1(TP)
Mult3: IC300.34(UV1) TP307.1(TP)
Mult4: IC300.33(UV0) TP306.1(TP)
Mult5: IC300.32(HYST) TP305.1(TP)
Mult6: IC300.31(CC1) TP304.1(TP)
Mult7: IC300.30(CC0) TP303.1(TP)
Mult8: IC300.27(DC) TP302.1(TP)
WDI: IC300.22(SOUT) IC301.1(WDI) TP311.1(TP)
NetC301_2: C301.2 IC300.19(~{EIN})
NetIC300_20: IC300.20(EIN) TP310.1(TP) ; port WatchdogIN
NetIC300_23: IC300.23(~{SIN}) IC300.25(~{EOUT})
NetIC300_24: IC300.24(SIN) IC300.26(EOUT)
NetIC300_28: IC300.28(SLTOK) ; port SLTOK
NetIC300_29: IC300.29(~{SLT}) ; port SLT
NetIC301_4: IC301.4(SET0) JS300.1 R300.2
NetIC301_5: IC301.5(SET1) JS301.1 R301.2
NetIC301_6: IC301.6(SET2) JS302.1 R302.2

Not connected (* = marked no-connect by the designer): IC300 21(~{SOUT})*; IC301 3(N.C.)*

### Buses and harness runs
bus A0_[1..8]
bus A1_[1..8]
bus Mult[1..8]

### Layout directives
net class Batt+: VBatt_LTC

### Notes on the sheet
- Temperature measurement disabled as configuration would happen with different temperature sensors
- Vreg 5V 1mA output
- (near C301) Recommended 1nF for single ended operation
- (near TP310) 2-50 kHz square wave required to wake up and put device in normal operation, if all cell voltages are within range the sqare wave comes out on the other side
- WDT
- the watchdog is there, to convert the square wave signal back into high/low signal, as side effect this also monitors MCU running correctly, consumption 22uA
- 1
- A1
- Otto Riha

### Library data of the parts
C300 C302 = 06035C105MAT2A: Capacitor 1uF 50V X7R; Manufacturer_Name: Kyocera AVX; Datasheet Link: https://componentsearchengine.com/Datasheets/1/06031A100FAT2A.pdf; Height: 0.9mm; Manufacturer_Part_Number: 06035C105MAT2A; Mouser Part Number: 581-06035C105MAT2A; Mouser Price/Stock: https://www.mouser.co.uk/ProductDetail/KYOCERA-AVX/06035C105MAT2A?qs=%252BdQmOuGyFcHMsevPtc6OZQ%3D%3D; Value: 1uF
C301 = 06033A102FAT2A: Capacitor 1nF 25V COG; Manufacturer_Name: Kyocera AVX; Datasheet Link: https://componentsearchengine.com/Datasheets/1/06031A100FAT2A.pdf; Height: 0.9mm; Manufacturer_Part_Number: 06033A102FAT2A; Mouser Part Number: 581-06033A102F; Mouser Price/Stock: https://www.mouser.com/Search/Refine.aspx?Keyword=581-06033A102F; Value: 1nF
C303 C304 = MAJCH168BB7104KTEA01: Capacitor 100nF, 100V, X7R; Manufacturer_Name: TAIYO YUDEN; Datasheet Link: https://ds.yuden.co.jp/TYCOMPAS/or/detail?pn=MAJCH168BB7104KTEA01; Height: 0.8mm; Manufacturer_Part_Number: MAJCH168BB7104KTEA01; Mouser Part Number: 963-MAJCH168BB7104KT; Mouser Price/Stock: https://www.mouser.co.uk/ProductDetail/TAIYO-YUDEN/MAJCH168BB7104KTEA01?qs=ZcfC38r4PovaTBrG0IdezQ%3D%3D; Arrow Part Number: MAJCH168BB7104KTEA01; Arrow Price/Stock: https://www.arrow.com/en/products/majch168bb7104ktea01/taiyo-yuden?utm_currency=USD&region=nac; Supplier 1: Mouser; Supplier Part Number 1: 963-MAJCH168BB7104KT
IC300 = LTC6801IG#3ZZPBF: Integrated Circuit; Manufacturer_Name: Analog Devices; Datasheet Link: https://www.analog.com/LTC6801/datasheet; Height: 2mm; Manufacturer_Part_Number: LTC6801IG#3ZZPBF; Mouser Part Number: 584-LTC6801IG#3ZZPBF; Mouser Price/Stock: https://www.mouser.com/Search/Refine.aspx?Keyword=584-LTC6801IG%233ZZPBF; Arrow Part Number: LTC6801IG#3ZZPBF; Arrow Price/Stock: https://www.arrow.com/en/products/ltc6801ig3zzpbf/analog-devices
IC301 = MAX6369KA_V+T: Integrated Circuit; Manufacturer_Name: Analog Devices; Manufacturer_Part_Number: MAX6369KA/V+T; Datasheet Link: https://pdfserv.maximintegrated.com/en/ds/MAX6369-MAX6374.pdf; Height: 1.45mm; Mouser Part Number: 700-MAX6369KA/V+T; Mouser Price/Stock: https://www.mouser.co.uk/ProductDetail/Analog-Devices-Maxim-Integrated/MAX6369KA-V%2bT?qs=Mc2rGIXtnyXSLiZoc8BdSg%3D%3D; Arrow Part Number: MAX6369KA/V+T; Arrow Price/Stock: https://www.arrow.com/en/products/max6369kavt/maxim-integrated?region=nac
R300-R302 = CRCW0603100KFKEAC: Resistor 100k, 1%; Manufacturer_Name: Vishay; Datasheet Link: https://www.mouser.com/datasheet/2/427/crcwce3-1223726.pdf; Height: 0.55mm; Manufacturer_Part_Number: CRCW0603100KFKEAC; Mouser Part Number: 71-CRCW0603100KFKEAC; Mouser Price/Stock: https://www.mouser.co.uk/ProductDetail/Vishay-Dale/CRCW0603100KFKEAC?qs=E3Y5ESvWgWPxzfNYyMgX1w%3D%3D; Arrow Part Number: CRCW0603100KFKEAC; Arrow Price/Stock: https://www.arrow.com/en/products/crcw0603100kfkeac/vishay?utm_currency=USD&region=nac; Value: 100k; Supplier 1: Mouser; Supplier Part Number 1: 71-CRCW0603100KFKEAC
R303 = CRCW0603100RFKEA: as R201 on sheet singlefilter; Datasheet Link: http://www.vishay.com/docs/20035/dcrcwe3.pdf; Height: 0.5mm; Manufacturer_Part_Number: CRCW0603100RFKEA; Mouser Part Number: 71-CRCW0603-100-E3; Mouser Price/Stock: https://www.mouser.co.uk/ProductDetail/Vishay-Dale/CRCW0603100RFKEA?qs=90AHS1y%2FsidGWjjxZAupKg%3D%3D; Arrow Part Number: CRCW0603100RFKEA; Arrow Price/Stock: https://www.arrow.com/en/products/crcw0603100rfkea/vishay?utm_currency=USD&region=europe; Supplier 1: Mouser; Supplier Part Number 1: 71-CRCW0603-100-E3

## Sheet ConfigMultiplexer.SchDoc
size A4; SheetNumber: 5; SheetTotal: 10
Used 8 times, as channels Hardware Protection/Multiplexer1, Hardware Protection/Multiplexer2, Hardware Protection/Multiplexer3, Hardware Protection/Multiplexer4, Hardware Protection/Multiplexer5, Hardware Protection/Multiplexer6, Hardware Protection/Multiplexer7, Hardware Protection/Multiplexer8. Parts and nets are listed once, with the designators drawn on the sheet.
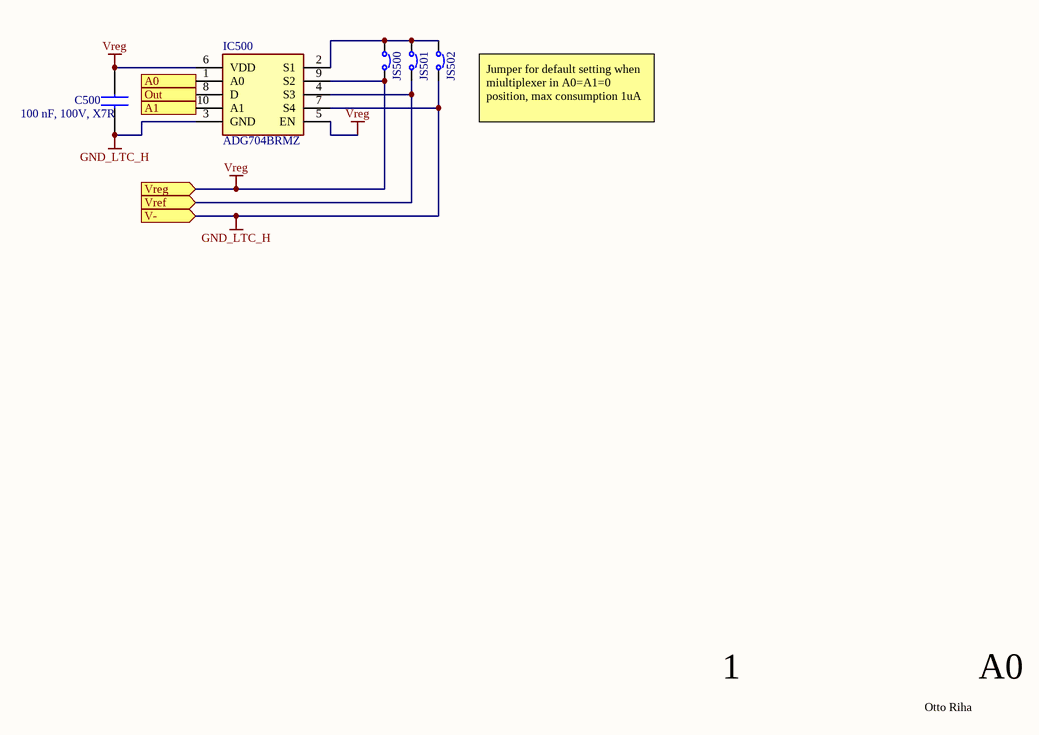
[diagram p4: ConfigMultiplexer.SchDoc]

### Parts
C500  100 nF, 100V, X7R  [MAJx16]
IC500  ADG704BRMZ  [SOP50P490X110-10N]
JS500  SolderJumper  [SolderJumper]  (value not drawn)
JS501  SolderJumper  [SolderJumper]  (value not drawn)
JS502  SolderJumper  [SolderJumper]  (value not drawn)

### Ports
A0 (in, see LTC_Hardware[3A]), A1 (in, see LTC_Hardware[3B]), Out (out, see LTC_Hardware[3B]), V- (in, see LTC_Hardware[3B]), Vref (in, see LTC_Hardware[3B]), Vreg (in, see LTC_Hardware[3A])

### Nets
GND_LTC_H: C500.1 IC500.3(GND) IC500.7(S4) JS502.1 ; port V-
Vreg: C500.2 IC500.5(EN) IC500.6(VDD) IC500.9(S2) JS500.1 ; port Vreg
A0: IC500.1(A0) ; port A0
A1: IC500.10(A1) ; port A1
Out: IC500.8(D) ; port Out
Vref: IC500.4(S3) JS501.1 ; port Vref
NetIC500_2: IC500.2(S1) JS500.2 JS501.2 JS502.2

### Channels
Hardware Protection/Multiplexer1: designators end in A; ports A0=A0_1 A1=A1_1 Out=Mult1 V-=Cell0 Vref=VrefH Vreg=Vreg
Hardware Protection/Multiplexer2: designators end in B; ports A0=A0_2 A1=A1_2 Out=Mult2 V-=Cell0 Vref=VrefH Vreg=Vreg
Hardware Protection/Multiplexer3: designators end in C; ports A0=A0_3 A1=A1_3 Out=Mult3 V-=Cell0 Vref=VrefH Vreg=Vreg
Hardware Protection/Multiplexer4: designators end in D; ports A0=A0_4 A1=A1_4 Out=Mult4 V-=Cell0 Vref=VrefH Vreg=Vreg
Hardware Protection/Multiplexer5: designators end in E; ports A0=A0_5 A1=A1_5 Out=Mult5 V-=Cell0 Vref=VrefH Vreg=Vreg
Hardware Protection/Multiplexer6: designators end in F; ports A0=A0_6 A1=A1_6 Out=Mult6 V-=Cell0 Vref=VrefH Vreg=Vreg
Hardware Protection/Multiplexer7: designators end in G; ports A0=A0_7 A1=A1_7 Out=Mult7 V-=Cell0 Vref=VrefH Vreg=Vreg
Hardware Protection/Multiplexer8: designators end in H; ports A0=A0_8 A1=A1_8 Out=Mult8 V-=Cell0 Vref=VrefH Vreg=Vreg

### Notes on the sheet
- (near JS502) Jumper for default setting when miultiplexer in A0=A1=0 position, max consumption 1uA
- 1
- A0
- Otto Riha

### Library data of the parts
C500 = MAJCH168BB7104KTEA01: as C303 on sheet LTC_Hardware; Datasheet Link: https://ds.yuden.co.jp/TYCOMPAS/or/detail?pn=MAJCH168BB7104KTEA01; Height: 0.8mm; Manufacturer_Part_Number: MAJCH168BB7104KTEA01; Mouser Part Number: 963-MAJCH168BB7104KT; Mouser Price/Stock: https://www.mouser.co.uk/ProductDetail/TAIYO-YUDEN/MAJCH168BB7104KTEA01?qs=ZcfC38r4PovaTBrG0IdezQ%3D%3D; Arrow Part Number: MAJCH168BB7104KTEA01; Arrow Price/Stock: https://www.arrow.com/en/products/majch168bb7104ktea01/taiyo-yuden?utm_currency=USD&region=nac; Supplier 1: Mouser; Supplier Part Number 1: 963-MAJCH168BB7104KT
IC500 = ADG704BRMZ: Integrated Circuit; Manufacturer_Name: Analog Devices; Datasheet Link: https://datasheet.datasheetarchive.com/originals/distributors/Datasheets-4/DSA-69549.pdf; Height: 1.1mm; Manufacturer_Part_Number: ADG704BRMZ; Mouser Part Number: 584-ADG704BRMZ; Mouser Price/Stock: https://www.mouser.co.uk/ProductDetail/Analog-Devices/ADG704BRMZ?qs=BpaRKvA4VqEkN1EGAKO1Aw%3D%3D; Arrow Part Number: ADG704BRMZ; Arrow Price/Stock: https://www.arrow.com/en/products/adg704brmz/analog-devices?utm_currency=USD&region=nac